# Altium schematic sheet 2018_Bat_Charger.SchDoc
size A4
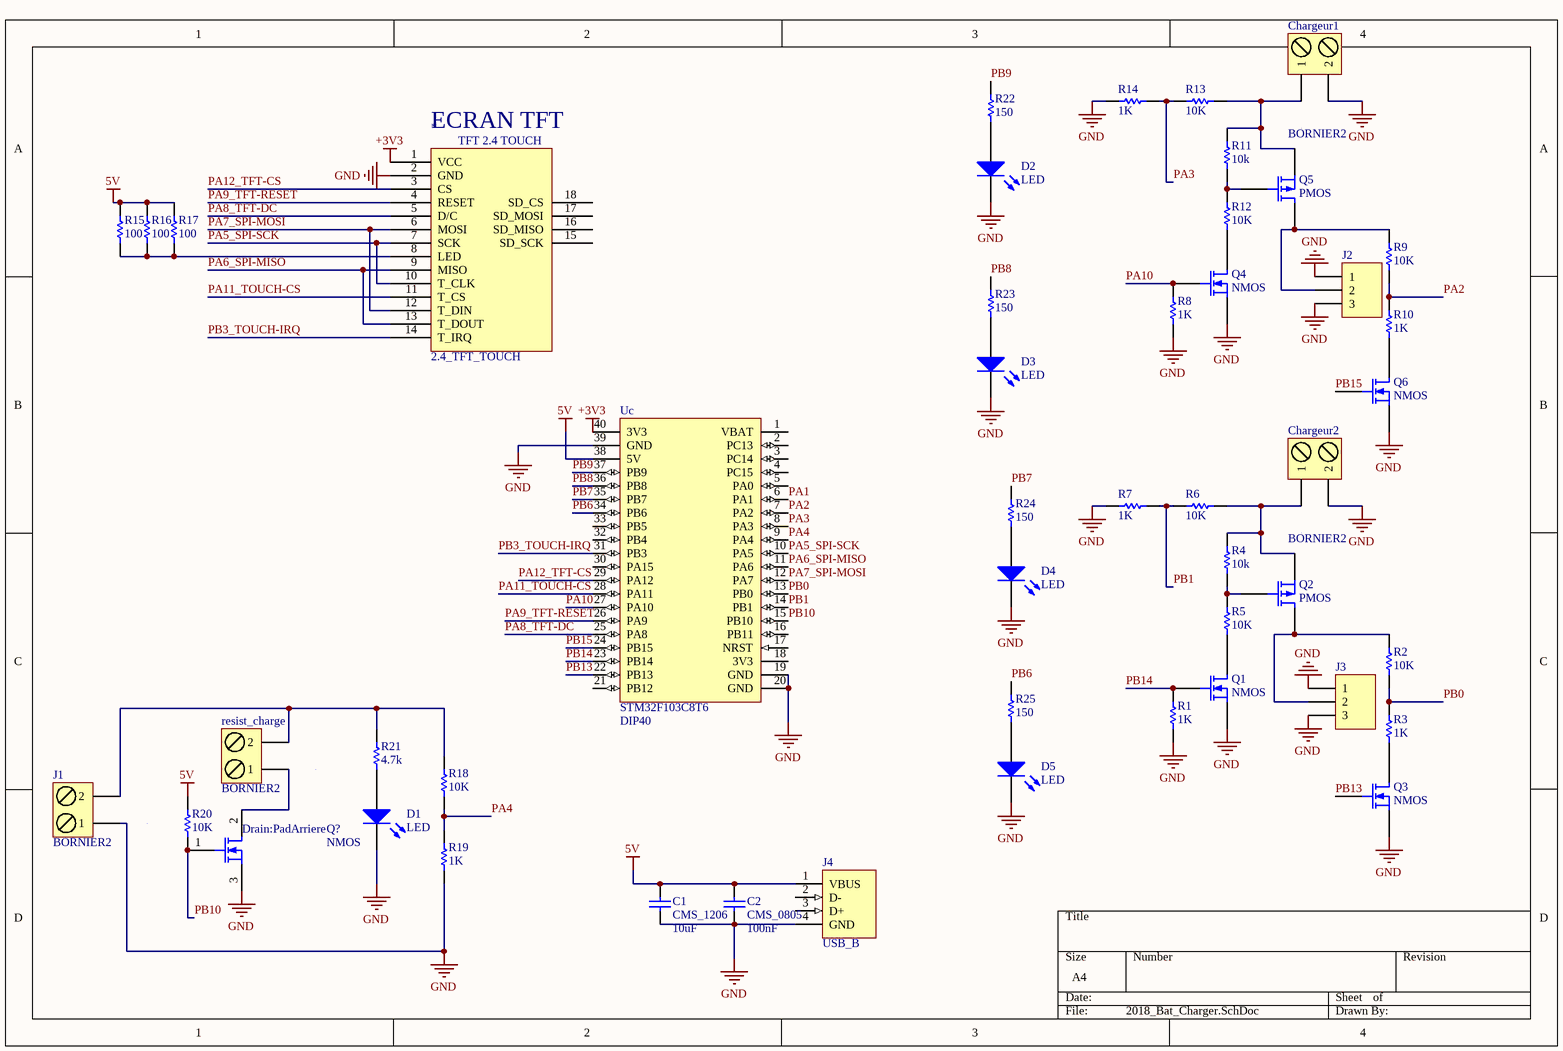
[diagram p0: 2018_Bat_Charger.SchDoc]

## Parts
*  2.4_TFT_TOUCH  [2.4_TFT_TOUCH]
C1  value 10uF  [CONDENSATEUR_CMS_1206]  (hidden comment: CMS_1206)
C2  value 100nF  [CONDENSATEUR_CMS_0805]  (hidden comment: CMS_0805)
Chargeur1  BORNIER2  [BORNIER2]
Chargeur2  BORNIER2  [BORNIER2]
D1  LED  [LED_0805]
D2  LED  [LED_0805]
D3  LED  [LED_0805]
D4  LED  [LED_0805]
D5  LED  [LED_0805]
J1  BORNIER2  [BORNIER2_FEM_COUDE]
J2  (no value)  [MOLEX3_2.5MM]
J3  (no value)  [MOLEX3_2.5MM]
J4  USB_B  [USB_B_C]
Q1  NMOS  [SOT23-3N]
Q2  PMOS  [SOT23-3N]
Q3  NMOS  [SOT23-3N]
Q4  NMOS  [SOT23-3N]
Q5  PMOS  [SOT23-3N]
Q6  NMOS  [SOT23-3N]
Q?  NMOS  [D2PAK_GROS_PAD]
R1  1K  [R0402_N]
R2  10K  [R0402_N]
R3  1K  [R0402_N]
R4  10k  [R0402_N]
R5  10K  [R0402_N]
R6  10K  [R0402_N]
R7  1K  [R0402_N]
R8  1K  [R0402_N]
R9  10K  [R0402_N]
R10  1K  [R0402_N]
R11  10k  [R0402_N]
R12  10K  [R0402_N]
R13  10K  [R0402_N]
R14  1K  [R0402_N]
R15  100  [R0402_N]
R16  100  [R0402_N]
R17  100  [R0402_N]
R18  10K  [R0402_N]
R19  1K  [R0402_N]
R20  10K  [R0402_N]
R21  4.7k  [R0402_N]
R22  150  [R0402_N]
R23  150  [R0402_N]
R24  150  [R0402_N]
R25  150  [R0402_N]
resist_charge  BORNIER2  [BORNIER2]
Uc  Type: STM32F103C8T6  Package: DIP40  [STM32F103C8T6_DIP40]  (hidden comment: STM32F103C8T6/PCB_DIP40)

## Nets
5V: C1.2 C2.2 J4.1(VBUS) R15.2 R16.2 R17.2 R20.2 Uc.38(5V)
+3V3: *.1(VCC) Uc.40(3V3)
GND: *.2(GND) C1.1 C2.1 Chargeur1.2 Chargeur2.2 D1.2(K) D2.2(K) D3.2(K) D4.2(K) D5.2(K) J1.1 J2.1 J2.3 J3.1 J3.3 J4.4(GND) Q1.2(S) Q3.2(S) Q4.2(S) Q6.2(S) Q?.3(S) R1.1 R7.1 R8.1 R14.1 R19.1 Uc.19(GND) Uc.20(GND) Uc.39(GND)
PA1: Uc.6(PA1)
PA2: R9.1 R10.2 Uc.7(PA2)
PA3: R13.1 R14.2 Uc.8(PA3)
PA4: R18.1 R19.2 Uc.9(PA4)
PA5_SPI-SCK: *.7(SCK) *.10(T_CLK) Uc.10(PA5)
PA6_SPI-MISO: *.9(MISO) *.13(T_DOUT) Uc.11(PA6)
PA7_SPI-MOSI: *.6(MOSI) *.12(T_DIN) Uc.12(PA7)
PA8_TFT-DC: *.5(D/C) Uc.25(PA8)
PA9_TFT-RESET: *.4(RESET) Uc.26(PA9)
PA10: Q4.1(G) R8.2 Uc.27(PA10)
PA11_TOUCH-CS: *.11(T_CS) Uc.28(PA11)
PA12_TFT-CS: *.3(CS) Uc.29(PA12)
PB0: R2.1 R3.2 Uc.13(PB0)
PB1: R6.1 R7.2 Uc.14(PB1)
PB3_TOUCH-IRQ: *.14(T_IRQ) Uc.31(PB3)
PB6: R25.2 Uc.34(PB6)
PB7: R24.2 Uc.35(PB7)
PB8: R23.2 Uc.36(PB8)
PB9: R22.2 Uc.37(PB9)
PB10: Q?.1(G) R20.1 Uc.15(PB10)
PB13: Q3.1(G) Uc.22(PB13)
PB14: Q1.1(G) R1.2 Uc.23(PB14)
PB15: Q6.1(G) Uc.24(PB15)
Net*_8: *.8(LED) R15.1 R16.1 R17.1
NetChargeur1_1: Chargeur1.1 Q5.3(S) R11.2 R13.2
NetChargeur2_1: Chargeur2.1 Q2.3(S) R4.2 R6.2
NetD1_1: D1.1(A) R21.1
NetD2_1: D2.1(A) R22.1
NetD3_1: D3.1(A) R23.1
NetD4_1: D4.1(A) R24.1
NetD5_1: D5.1(A) R25.1
NetJ1_2: J1.2 R18.2 R21.2 resist_charge.2
NetJ2_2: J2.2 Q5.1(D) R9.2
NetJ3_2: J3.2 Q2.1(D) R2.2
NetQ1_3: Q1.3(D) R5.1
NetQ2_2: Q2.2(G) R4.1 R5.2
NetQ3_3: Q3.3(D) R3.1
NetQ4_3: Q4.3(D) R12.1
NetQ5_2: Q5.2(G) R11.1 R12.2
NetQ6_3: Q6.3(D) R10.1
NetQ?_2: Q?.2(D) resist_charge.1

Not connected (* = marked no-connect by the designer): * 15(SD_SCK) 16(SD_MISO) 17(SD_MOSI) 18(SD_CS); J4 2(D-) 3(D+); Uc 1(VBAT) 2(PC13) 3(PC14) 4(PC15) 5(PA0) 16(PB11) 17(NRST) 18(3V3) 21(PB12) 30(PA15) 32(PB4) 33(PB5)

## Notes on the sheet
- (near *) ECRAN TFT
- (in symbol 2.4_TFT_TOUCH) TFT 2.4 TOUCH
- (in symbol Transistor MOSFET-N AUIRF1018ES) Drain:PadArriere

## Library data of the parts
C1 = CONDENSATEUR_CMS_CER_1206: CONDENSATEUR CMS CERAMIQUE 1206; Type: CMS_1206
C2 = CONDENSATEUR_CMS_CER_0805: CONDENSATEUR CMS CERAMIQUE 0805; Type: CMS_0805
Chargeur1 Chargeur2 J1 resist_charge = BORNIER2: Terminal blocks, 2 pins, pitch=5mm
D1-D5 = LED: Typical LED; Published: 8-Jun-2000; LatestRevisionDate: 08-Jul-2005; LatestRevisionNote: Mech Layer 1 removed.; PackageReference: LED-1; Publisher: Altium Limited
J2 J3 = BARRETTE3: Header, 3-Pin; LatestRevisionDate: 17-Jul-2002; LatestRevisionNote: Re-released for DXP Platform.; Publisher: Altium Limited
J4 = USB_B: EMBASE USB TRAVERSANTE TYPE B; Type: USB_B
Q1 Q3 Q4 Q6 = Transistor MOSFET-N: N-Channel MOSFET; PackageDocument: 1995/1996; Published: 8-Jun-2000; LatestRevisionDate: 17-Jul-2002; LatestRevisionNote: Re-released for DXP Platform.; PackageReference: E3; Publisher: Altium Limited
Q2 Q5 = Transistor MOSFET-P: P-Channel MOSFET; PackageDocument: 1995/1996; Published: 8-Jun-2000; LatestRevisionDate: 17-Jul-2002; LatestRevisionNote: Re-released for DXP Platform.; PackageReference: E3; Publisher: Altium Limited
Q? = Transistor MOSFET-N AUIRF1018ES: N-Channel MOSFET; PackageDocument: 1995/1996; Published: 8-Jun-2000; LatestRevisionDate: 17-Jul-2002; LatestRevisionNote: Re-released for DXP Platform.; PackageReference: E3; Publisher: Altium Limited
R1-R25 = Resistor: Published: 8-Jun-2000; LatestRevisionDate: 17-Jul-2002; LatestRevisionNote: Re-released for DXP Platform.; PackageReference: AXIAL-0.5; Publisher: Altium Limited
Uc = STM32F103C8T6/PCB_DIP40: MICROCONTROLEUR 32 BITS - 72MHz - 34 I/O - 64 KO : FLASH - 20KO RAM - 10 CANAUX A/D 12 BITS - DIP40 - UART, SPI, I2C, USB, CAN